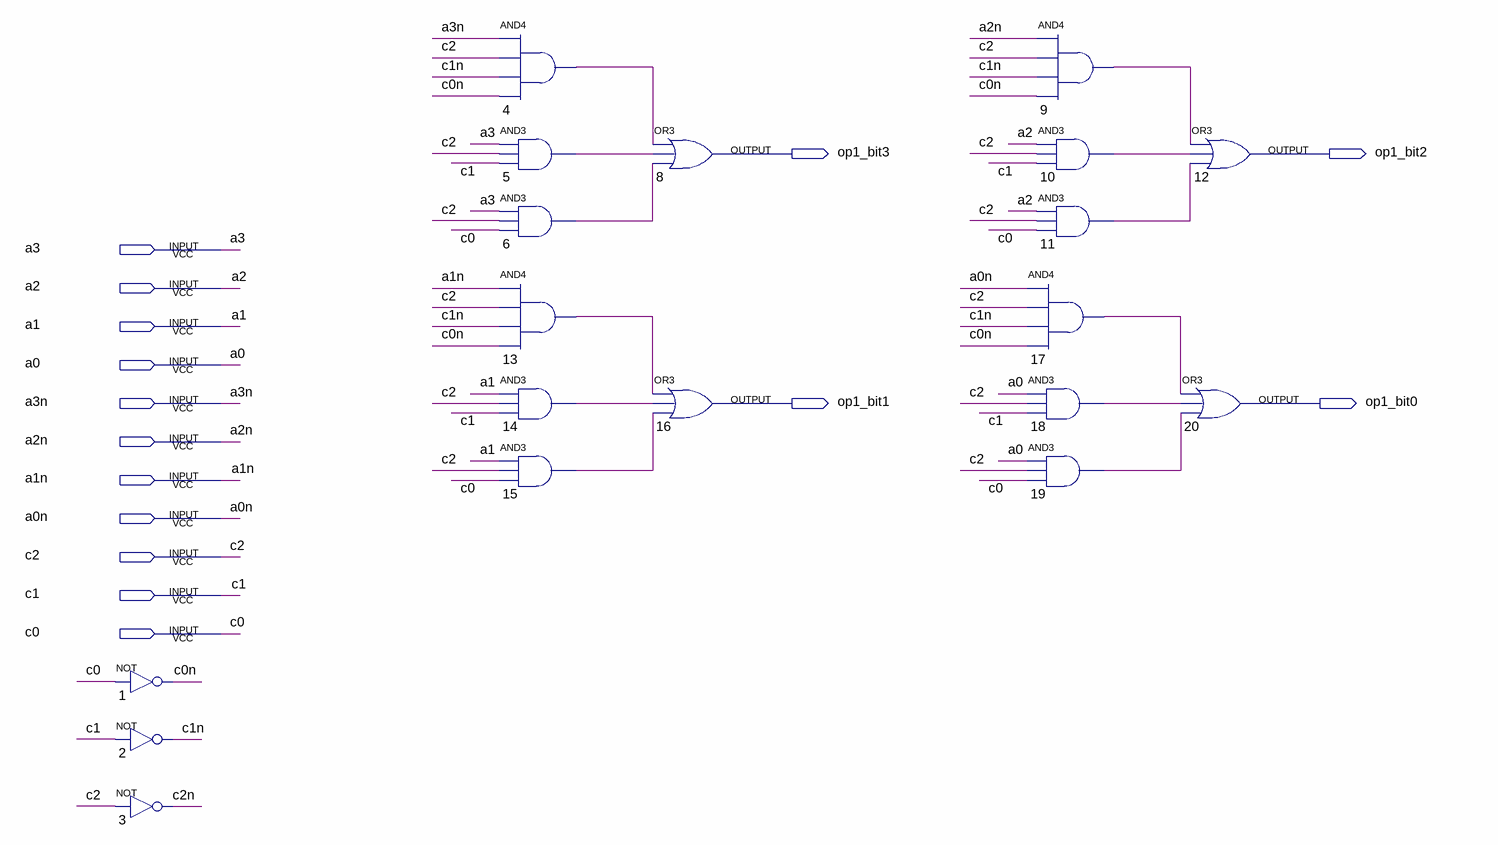
[diagram p0: schematic sheet]
// Quartus schematic mux_operando1soma.bdf as structural Verilog: 19 symbols, 15 pins
module mux_operando1soma (
  input  a3,
  input  a2,
  input  a1,
  input  a0,
  input  a3n,
  input  a2n,
  input  a1n,
  input  a0n,
  input  c2,
  input  c1,
  input  c0,
  output op1_bit3,
  output op1_bit2,
  output op1_bit1,
  output op1_bit0
);

  wire c0n, c1n, c2n, n4_out, n5_out, n6_out, n9_out, n10_out, n11_out, n13_out, n14_out, n15_out, n17_out,
       n18_out, n19_out;

  not u_1 (c0n, c0);
  not u_2 (c1n, c1);
  not u_3 (c2n, c2);
  and u_4 (n4_out, a3n, c2, c1n, c0n);
  and u_5 (n5_out, a3, c2, c1);
  and u_6 (n6_out, a3, c2, c0);
  and u_13 (n13_out, a1n, c2, c1n, c0n);
  and u_14 (n14_out, a1, c2, c1);
  and u_15 (n15_out, a1, c2, c0);
  or u_8 (op1_bit3, n4_out, n5_out, n6_out);
  or u_16 (op1_bit1, n13_out, n14_out, n15_out);
  and u_9 (n9_out, a2n, c2, c1n, c0n);
  and u_10 (n10_out, a2, c2, c1);
  and u_11 (n11_out, a2, c2, c0);
  and u_17 (n17_out, a0n, c2, c1n, c0n);
  and u_18 (n18_out, a0, c2, c1);
  and u_19 (n19_out, a0, c2, c0);
  or u_12 (op1_bit2, n9_out, n10_out, n11_out);
  or u_20 (op1_bit0, n17_out, n18_out, n19_out);
endmodule
